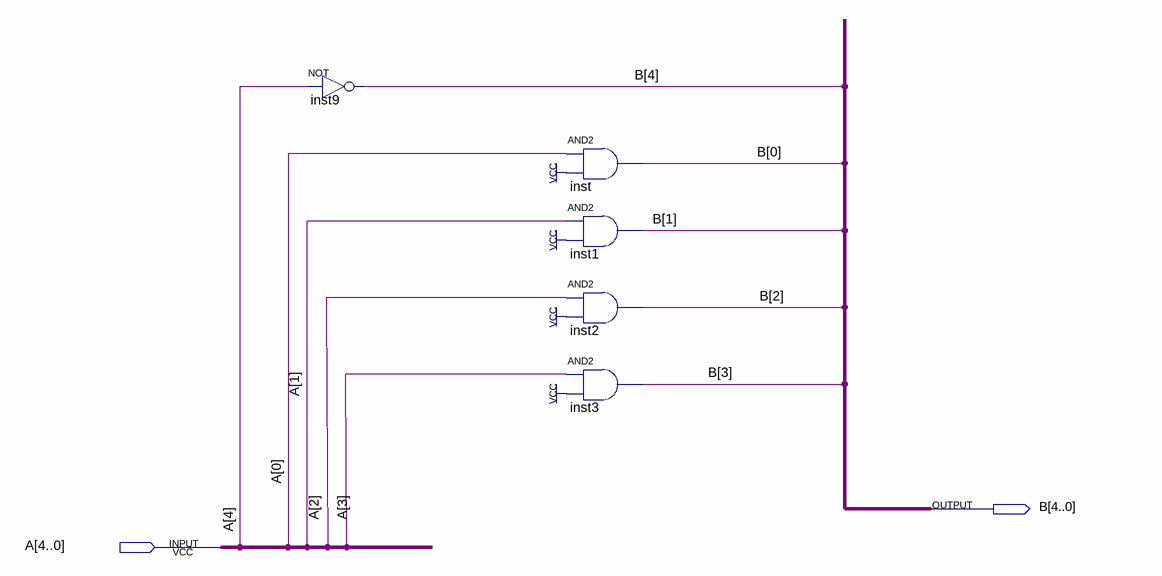
[diagram p0: schematic sheet]
// Quartus schematic Inverter_sinal.bdf as structural Verilog: 5 symbols, 2 pins
module Inverter_sinal (
  input  [4:0] A,
  output [4:0] B
);

  not inst9 (B[4], A[4]);
  and inst (B[0], A[0], 1'b1);
  and inst1 (B[1], A[1], 1'b1);
  and inst2 (B[2], A[2], 1'b1);
  and inst3 (B[3], A[3], 1'b1);
endmodule
